# EAGLE schematic Instrumentation_amplifier_MSP430FR2355 (EAGLE 9.3.1)
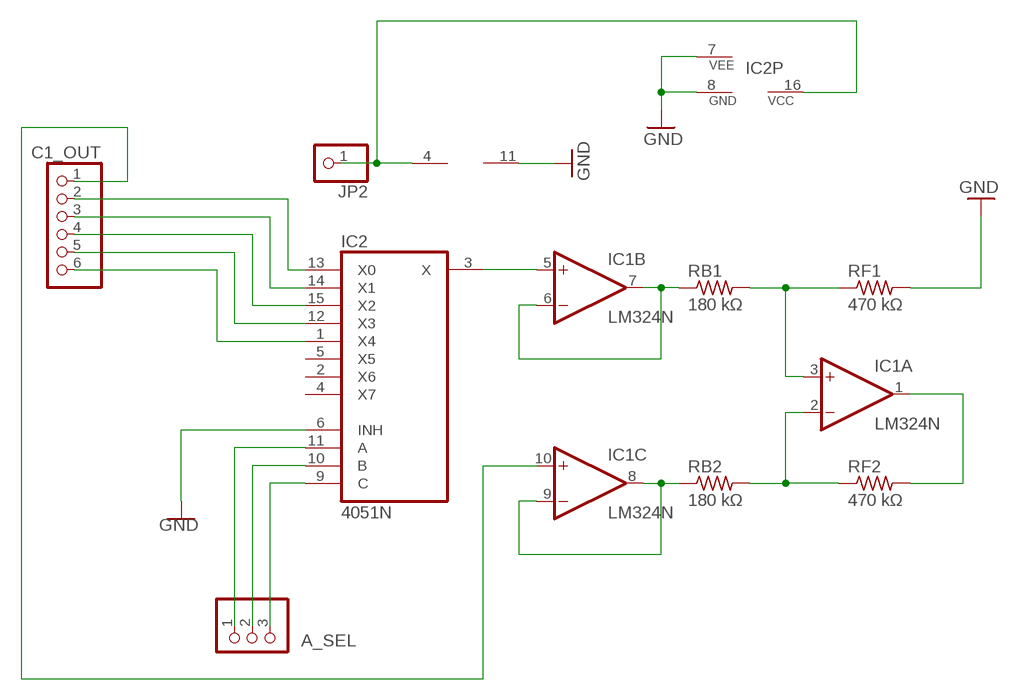
[diagram p0: schematic, sheet 1]

## Parts
A_SEL  PINHD-1X3  [1X03]
C1_OUT  PINHD-1X6  [1X06]
IC1  LM324N  [DIL14]
IC2  4051N  [DIL16]
JP2  PINHD-1X1  [1X01]
RB1  180 kΩ  R-US_0204/7  [0204/7]
RB2  180 kΩ  R-US_0204/7  [0204/7]
RF1  470 kΩ  R-US_0204/7  [0204/7]
RF2  470 kΩ  R-US_0204/7  [0204/7]

## Nets
GND: IC1.11(P:V-) IC2.6(INH) IC2.7(VEE) IC2.8(GND) RF1.2
N$1: C1_OUT.1 IC1.10(C:+IN)
N$2: IC1.8(C:OUT) IC1.9(C:-IN) RB2.1
N$3: IC1.2(A:-IN) RB2.2 RF2.1
N$4: IC1.6(B:-IN) IC1.7(B:OUT) RB1.1
N$5: IC1.3(A:+IN) RB1.2 RF1.1
N$6: C1_OUT.2 IC2.13(X0)
N$7: IC1.1(A:OUT) RF2.2
N$8: C1_OUT.3 IC2.14(X1)
N$9: C1_OUT.4 IC2.15(X2)
N$10: IC1.4(P:V+) IC2.16(VCC) JP2.1
N$11: IC1.5(B:+IN) IC2.3(X)
N$12: C1_OUT.5 IC2.12(X3)
N$13: C1_OUT.6 IC2.1(X4)
N$14: A_SEL.1 IC2.11(A)
N$15: A_SEL.2 IC2.10(B)
N$16: A_SEL.3 IC2.9(C)
Unconnected: IC1.12(D:+IN) IC1.13(D:-IN) IC1.14(D:OUT) IC2.2(X6) IC2.4(X7) IC2.5(X5)

## Library data of the parts
A_SEL = pinhead:PINHD-1X3: PIN HEADER
C1_OUT = pinhead:PINHD-1X6: PIN HEADER
IC1 = linear:LM324: OP AMP
IC2 = 40xx:4051: 8-channel ANALOG MULTIPLEXER
JP2 = pinhead:PINHD-1X1: PIN HEADER
RB1 RB2 RF1 RF2 = rcl:R-US_: RESISTOR, American symbol; SPICEPREFIX: R